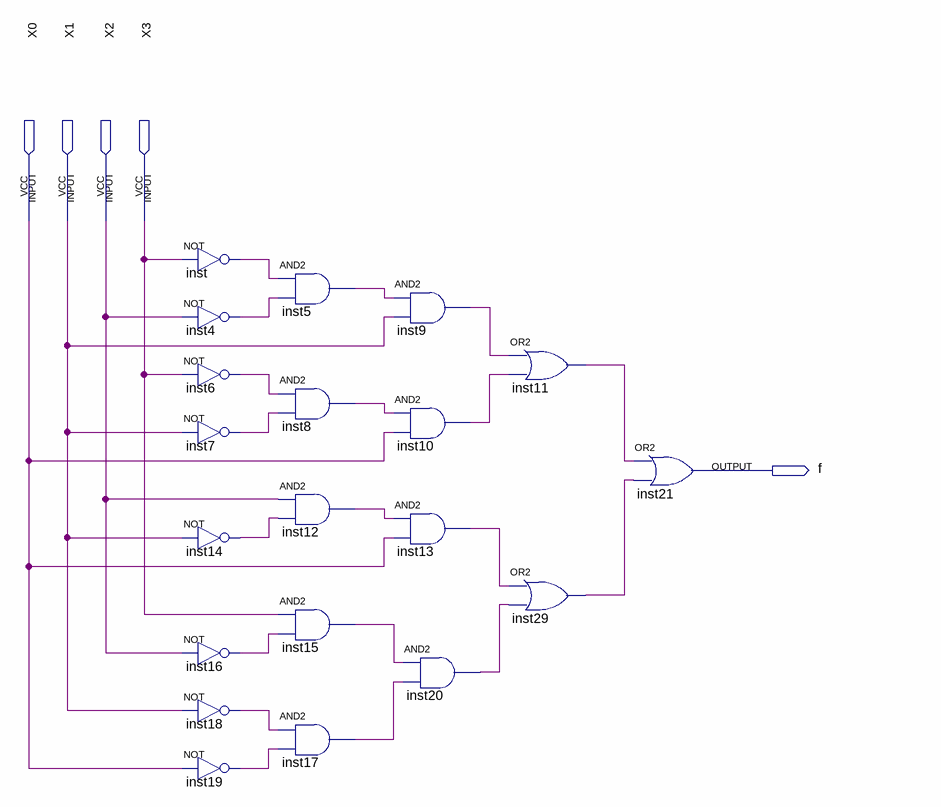
[diagram p0: schematic sheet]
// Quartus schematic lab1.bdf as structural Verilog: 20 symbols, 5 pins
module lab1 (
  input  X0,
  input  X1,
  input  X2,
  input  X3,
  output f
);

  wire inst4_out, inst5_out, inst6_out, inst7_out, inst8_out, inst9_out, inst10_out, inst11_out, inst12_out,
       inst13_out, inst14_out, inst15_out, inst16_out, inst17_out, inst18_out, inst19_out, inst20_out,
       inst29_out, inst_out;

  not inst (inst_out, X3);
  not inst4 (inst4_out, X2);
  not inst6 (inst6_out, X3);
  not inst7 (inst7_out, X1);
  not inst14 (inst14_out, X1);
  not inst16 (inst16_out, X2);
  not inst18 (inst18_out, X1);
  not inst19 (inst19_out, X0);
  and inst5 (inst5_out, inst_out, inst4_out);
  and inst8 (inst8_out, inst6_out, inst7_out);
  and inst12 (inst12_out, X2, inst14_out);
  and inst15 (inst15_out, X3, inst16_out);
  and inst17 (inst17_out, inst18_out, inst19_out);
  and inst9 (inst9_out, inst5_out, X1);
  and inst10 (inst10_out, inst8_out, X0);
  and inst13 (inst13_out, inst12_out, X0);
  and inst20 (inst20_out, inst15_out, inst17_out);
  or inst11 (inst11_out, inst9_out, inst10_out);
  or inst29 (inst29_out, inst13_out, inst20_out);
  or inst21 (f, inst11_out, inst29_out);
endmodule
